# Altium project PCB_Project1.PrjPCB
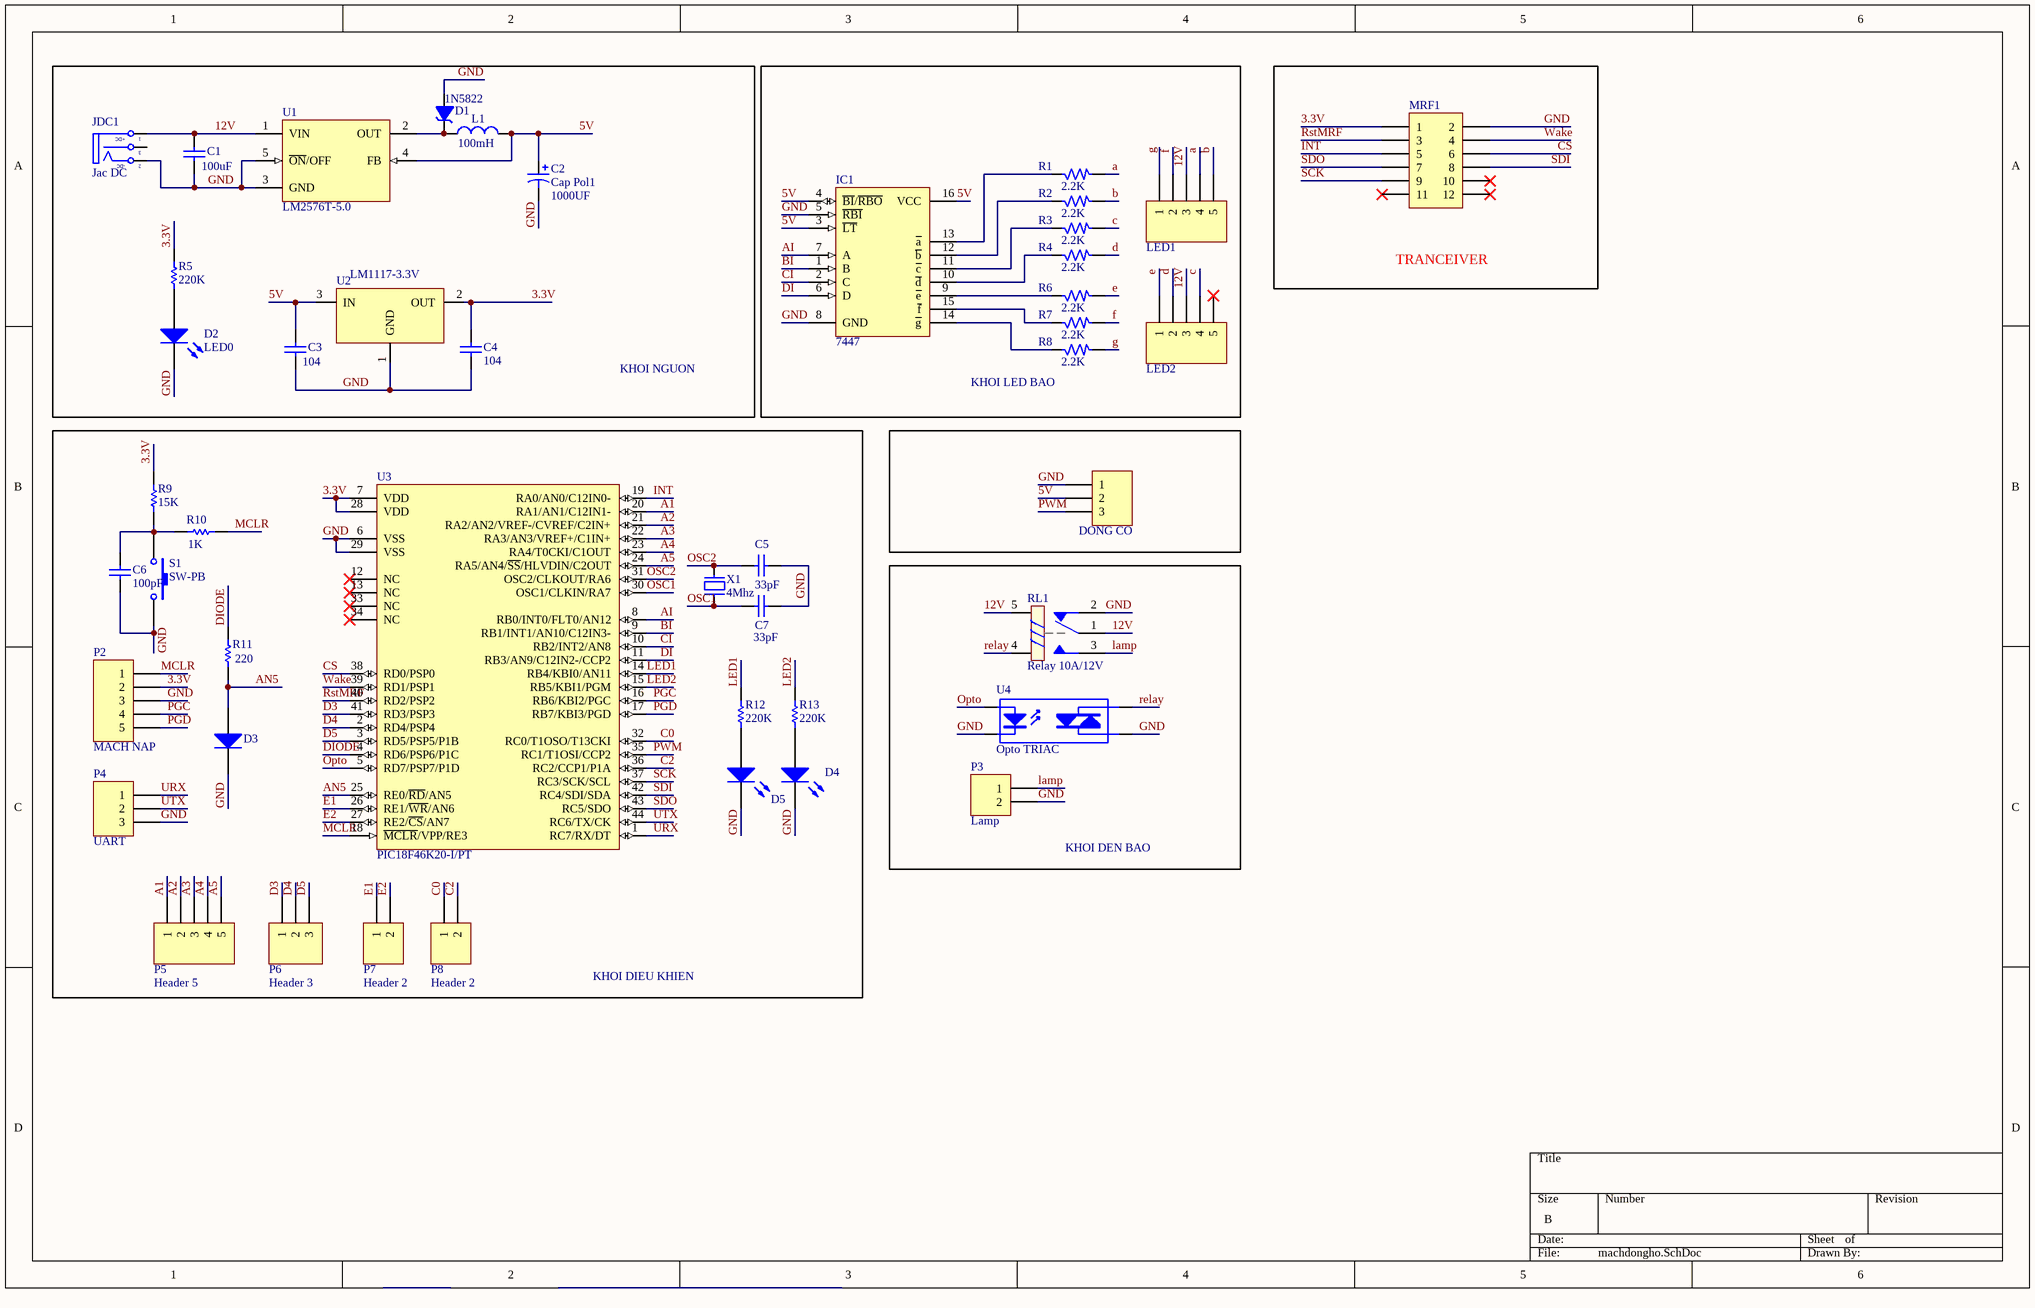
[diagram p0: machdongho.SchDoc]
1 sheet, 46 parts. Net scope: global (net labels, ports and power ports of the same name join across sheets).
Board file: machdongho.PcbDoc

## Sheet machdongho.SchDoc
size B

### Parts
C1  value 100uF  [SMD Capacistor 1206]  (hidden comment: Cap)
C2  Cap Pol1  value 1000UF  [SMD Capacistor 1206]
C3  value 104  [SM-0805]  (hidden comment: Cap)
C4  value 104  [SM-0805]  (hidden comment: Cap)
C5  value 33pF  [SM-0805]
C6  value 100pF  [SM-0805]  (hidden comment: Cap)
C7  value 33pF  [SM-0805]
D1  1N5822  [DZ0.5A]
D2  LED0  [LED-5 GRe]
D3  Diode  [SMC]  (value not drawn)
D4  (no value)  [LED-5 GRe]
D5  (no value)  [LED-5 GRe]
IC1  7447  [DIP16/W0.3]
JDC1  Jac DC  [DC-IN]
L1  100mH  [L/0.4]
LED1  Led7  [HDR1X5]  (value not drawn)
LED2  Led7  [HDR1X5]  (value not drawn)
MRF1  Header 6X2  [MRF24J40MB_board_mini]  (value not drawn)
P1  DONG CO  [HDR1X3]
P2  MACH NAP  [HDR1X5]
P3  Lamp  [HDR1X2]
P4  UART  [HDR1X3]
P5  Header 5  [HDR1X5]
P6  Header 3  [HDR1X3]
P7  Header 2  [HDR1X2]
P8  Header 2  [HDR1X2]
R1  2.2K  [SM-0805]
R2  2.2K  [SM-0805]
R3  2.2K  [SM-0805]
R4  2.2K  [SM-0805]
R5  value 220K  [SM-0805]  (hidden comment: Res1)
R6  2.2K  [SM-0805]
R7  2.2K  [SM-0805]
R8  2.2K  [SM-0805]
R9  value 15K  [SM-0805]
R10  value 1K  [SM-0805]  (hidden comment: Res Semi)
R11  value 220  [SM-0805]  (hidden comment: Res1)
R12  value 220K  [SM-0805]  (hidden comment: Res1)
R13  value 220K  [SM-0805]  (hidden comment: Res1)
RL1  Relay 10A/12V  [RL_SPDT_10A]
S1  SW-PB  [SW2]
U1  LM2576T-5.0  [LM2576t]
U2  LM1117-3.3V  [LM1117-SOP]
U3  PIC18F46K20-I/PT  [TQFP-PT44_N]
U4  Opto TRIAC  [DIP4/W0.3]
X1  4Mhz  [XT2]

### Blocks framed on the sheet
KHOI NGUON: C1-C4 D1 D2 JDC1 L1 R5 U1 U2
KHOI LED BAO: IC1 LED1 LED2 R1-R4 R6-R8
TRANCEIVER: MRF1
KHOI DIEU KHIEN: C5-C7 D3-D5 P2 P4-P8 R9-R13 S1 U3 X1
KHOI DEN BAO: P3 RL1 U4

### Nets
3.3V: C4.2 MRF1.1 P2.2 R5.1 R9.2 U2.2(OUT) U3.7(VDD) U3.28(VDD)
5V: C2.1 C3.2 IC1.3(~{LT}) IC1.4(~{BI}/~{RBO}) IC1.16(VCC) L1.2 P1.2 U1.4(FB) U2.3(IN)
12V: C1.2 JDC1.1(T) LED1.3 LED2.3 RL1.1 RL1.5 U1.1(VIN)
a: LED1.4 R1.2
A1: P5.1 U3.20(RA1/AN1/C12IN1-)
A2: P5.2 U3.21(RA2/AN2/VREF-/CVREF/C2IN+)
A3: P5.3 U3.22(RA3/AN3/VREF+/C1IN+)
A4: P5.4 U3.23(RA4/T0CKI/C1OUT)
A5: P5.5 U3.24(RA5/AN4/~{SS}/HLVDIN/C2OUT)
AI: IC1.7(A) U3.8(RB0/INT0/FLT0/AN12)
AN5: D3.1(A) R11.1 U3.25(RE0/~{RD}/AN5)
b: LED1.5 R2.2
BI: IC1.1(B) U3.9(RB1/INT1/AN10/C12IN3-)
c: LED2.4 R3.2
C0: P8.1 U3.32(RC0/T1OSO/T13CKI)
C2: P8.2 U3.36(RC2/CCP1/P1A)
CI: IC1.2(C) U3.10(RB2/INT2/AN8)
CS: MRF1.6 U3.38(RD0/PSP0)
d: LED2.2 R4.2
D3: P6.1 U3.41(RD3/PSP3)
D4: P6.2 U3.2(RD4/PSP4)
D5: P6.3 U3.3(RD5/PSP5/P1B)
DI: IC1.6(D) U3.11(RB3/AN9/C12IN2-/CCP2)
DIODE: R11.2 U3.4(RD6/PSP6/P1C)
e: LED2.1 R6.2
E1: P7.1 U3.26(RE1/~{WR}/AN6)
E2: P7.2 U3.27(RE2/~{CS}/AN7)
f: LED1.2 R7.2
g: LED1.1 R8.2
GND: C1.1 C2.2 C3.1 C4.1 C5.1 C6.2 C7.1 D1.1(A) D2.2(K) D3.2(K) D4.2(K) D5.2(K) IC1.5(~{RBI}) IC1.8(GND) JDC1.2(TN) MRF1.2 P1.1 P2.3 P3.2 P4.3 RL1.2 S1.2 U1.3(GND) U1.5(~{ON}/OFF) U2.1(GND) U3.6(VSS) U3.29(VSS) U4.2(K) U4.4(A/K)
INT: MRF1.5 U3.19(RA0/AN0/C12IN0-)
lamp: P3.1 RL1.3
LED1: R12.1 U3.14(RB4/KBI0/AN11)
LED2: R13.1 U3.15(RB5/KBI1/PGM)
MCLR: P2.1 R10.2 U3.18(~{MCLR}/VPP/RE3)
Opto: U3.5(RD7/PSP7/P1D) U4.1(A)
OSC1: C7.2 U3.30(OSC1/CLKIN/RA7) X1.1
OSC2: C5.2 U3.31(OSC2/CLKOUT/RA6) X1.2
PGC: P2.4 U3.16(RB6/KBI2/PGC)
PGD: P2.5 U3.17(RB7/KBI3/PGD)
PWM: P1.3 U3.35(RC1/T1OSI/CCP2)
relay: RL1.4 U4.3(A/K)
RstMRF: MRF1.3 U3.40(RD2/PSP2)
SCK: MRF1.9 U3.37(RC3/SCK/SCL)
SDI: MRF1.8 U3.42(RC4/SDI/SDA)
SDO: MRF1.7 U3.43(RC5/SDO)
URX: P4.1 U3.1(RC7/RX/DT)
UTX: P4.2 U3.44(RC6/TX/CK)
Wake: MRF1.4 U3.39(RD1/PSP1)
NetC6_1: C6.1 R9.1 R10.1 S1.1
NetD1_2: D1.2(K) L1.1 U1.2(OUT)
NetD2_1: D2.1(A) R5.2
NetD4_1: D4.1(A) R13.2
NetD5_1: D5.1(A) R12.2
NetIC1_9: IC1.9(~{e}) R6.1
NetIC1_10: IC1.10(~{d}) R4.1
NetIC1_11: IC1.11(~{c}) R3.1
NetIC1_12: IC1.12(~{b}) R2.1
NetIC1_13: IC1.13(~{a}) R1.1
NetIC1_14: IC1.14(~{g}) R8.1
NetIC1_15: IC1.15(~{f}) R7.1

Not connected (* = marked no-connect by the designer): JDC1 3(S); LED2 5*; MRF1 10* 11* 12*; U3 12(NC)* 13(NC)* 33(NC)* 34(NC)*

### Notes on the sheet
- (in symbol DCIN) +DC; -DC

### Library data of the parts
C1 C3-C7 = Cap: Capacitor; Published: 8-Jun-2000; LatestRevisionDate: 17-Jul-2002; LatestRevisionNote: Re-released for DXP Platform.; PackageReference: RAD-0.3; Publisher: Altium Limited; PackageDescription: Radial Cap, Thru-Hole; 2 Leads; 0.3 in Pin Spacing
C2 = Cap Pol1: Polarized Capacitor (Radial); Published: 8-Jun-2000; LatestRevisionDate: 17-Jul-2002; LatestRevisionNote: Re-released for DXP Platform.; PackageReference: RB7.6-15; Publisher: Altium Limited; PackageDescription: Polarized Capacitor (Radial); 2 Leads
D1 = DZ: Diode Zenner; Value: 3v3
D2 D4 D5 = LED0: Typical INFRARED GaAs LED; Published: 8-Jun-2000; LatestRevisionDate: 08-Jul-2005; LatestRevisionNote: Mech Layer 1 removed.; PackageReference: LED-0; Publisher: Altium Limited; PackageDescription: LED; 2 Leads
D3 = Diode: Default Diode; Published: 8-Jun-2000; LatestRevisionDate: 17-Jul-2002; LatestRevisionNote: Re-released for DXP Platform.; PackageVersion: Sep-1996; PackageReference: SMC; Publisher: Altium Limited; PackageDescription: DO-214-AB/SMC; 2 C-Bend Leads; Body 7.9 x 5.9 mm, inc. leads (LxW); Code_JEDEC: DO-214-AB
IC1 = 7447: BCD to 7-Segment Decoder/Driver; Value: 7447 , 74247; Description: VanDungEvn
JDC1 = DCIN: Jac DC input; Value: Jac DC
L1 = L1: Inductor; Value: 150 mH
LED1 LED2 P2 P5 = Header 5: Header, 5-Pin; LatestRevisionDate: 17-Jul-2002; LatestRevisionNote: Re-released for DXP Platform.; Publisher: Altium Limited
MRF1 = Header 6X2: Header, 6-Pin, Dual row; LatestRevisionDate: 17-Jul-2002; LatestRevisionNote: Re-released for DXP Platform.; Publisher: Altium Limited
P1 P4 P6 = Header 3: Header, 3-Pin; LatestRevisionDate: 17-Jul-2002; LatestRevisionNote: Re-released for DXP Platform.; Publisher: Altium Limited
P3 P7 P8 = Header 2: Header, 2-Pin; LatestRevisionDate: 17-Jul-2002; LatestRevisionNote: Re-released for DXP Platform.; Publisher: Altium Limited
R1-R4 R6-R8 = R: Resistor 1/4W; Value: R1/4W - 1K
R5 R9 R11-R13 = Res1: Resistor; Published: 8-Jun-2000; LatestRevisionDate: 17-Jul-2002; LatestRevisionNote: Re-released for DXP Platform.; PackageReference: AXIAL-0.3; Publisher: Altium Limited; PackageDescription: Axial Device, Thru-Hole; 2 Leads; 0.3 in Pin Spacing
R10 = Res Semi: Semiconductor Resistor; Published: 8-Jun-2000; LatestRevisionDate: 17-Jul-2002; LatestRevisionNote: Re-released for DXP Platform.; PackageReference: AXIAL-0.5; Publisher: Altium Limited; PackageDescription: Axial Device, Thru-Hole; 2 Leads; 0.5 in Pin Spacing
RL1 = Relay 1: Relay SPDT,10A - 12VDC 5 Pin; Value: Relay SPDT, 10A, 12V
S1 = SW-PB: Switch; Published: 24-Mar-1999; LatestRevisionDate: 17-Jul-2002; LatestRevisionNote: Re-released for DXP Platform.; PackageReference: SPST-2; Publisher: Altium Limited; PackageDescription: Switch; 2 Leads
U1 = LM2576T-5.0: SIMPLE SWITCHER; 3A Step-Down Voltage Regulator; Manufacturer: National Semiconductor; PackageTopMarking: NSUZXYTT*LM2576T*-5.0 P+; PowerWise: N; FirstPublished: 4-Dec-2008; DatasheetVersion: Aug-2004; PackageVersion: revJ, Jan-1992; PackageReference: T05A; Publisher: Altium Limited; PackageDescription: TO-220, Molded, 5 Lead, Straight; CompType: Switcher; PartNumber: LM2576T-5.0; RoHS: O; PinCount: 5; DigiKeyPartNumber: LM2576T-5.0-ND; Code_JEDEC: TO-220-AB; ComponentLink1Description: LM2576 Datasheet; ComponentLink1URL: http://www.national.com/ds/LM/LM2576.pdf; ComponentLink2Description: LM2576 Web Page; ComponentLink2URL: http://www.national.com/pf/LM/LM2576.html; ComponentLink3Description: T05A Package Page; ComponentLink3URL: http://www.national.com/packaging/folders/t05a.html
U2 = LM1117: 800mA Low-Dropout Linear Regulator; Creator: Nguyen Ba Bien; Website: http://group3i.net
U3 = PIC18F46K20-I/PT: Flash Microcontroller with 10-Bit A/D and nanoWatt Technology, 32K Flash, 44-Pin TQFP, Industrial Temperature Range; FirstPublished: 2-Dec-2009; DatasheetVersion: revF, Sep-2009; PackageVersion: revBB, Aug-2009; PackageReference: TQFP-PT44; Publisher: Altium Limited; PackageDescription: 44-Lead Plastic Thin Quad Flatpack (PT) - 10x10x1mm Body, 2.00mm [TQFP]; Supplier 1: Digi-Key; Supplier Part Number 1: PIC18F46K20-I/PT-ND; Supplier 2: Farnell; Supplier Part Number 2: 1439591; Supplier 3: Newark; Supplier Part Number 3: 88K6058; Code_JEDEC: MS-026; ComponentLink1Description: Datasheet; ComponentLink1URL: http://ww1.microchip.com/downloads/en/DeviceDoc/41303F.pdf; ComponentLink2Description: Packaging Specification; ComponentLink2URL: http://www.microchip.com/stellent/groups/techpub_sg/documents/packagingspec/en012702.pdf; ComponentLink3Description: Microchip.com Home; ComponentLink3URL: http://www.microchip.com/
U4 = Opto TRIAC: Opto-Triac; Published: 24-Mar-1999; LatestRevisionDate: 17-Jul-2002; LatestRevisionNote: Re-released for DXP Platform.; PackageReference: NPSIP4A; Publisher: Altium Limited; PackageDescription: SIP; 4 Leads; Body 10 x 11.5 x 7.5 mm (typ); Pitch 2.54 mm
X1 = XT2: Crystal For all Crystal 2pin.; Value: 4Mhz